# Altium schematic sheet 3.ETC.SchDoc
size A4; DrawnBy: Peter; Organization: WIZnet Co., Ltd.; Address1: 5F, Humax Village; Address2: Hwangseaul-ro, Bundang-Gu; Address3: Seongnam-Si, Gyeonggi-Do; Address4: South Korea; Team: Wiki
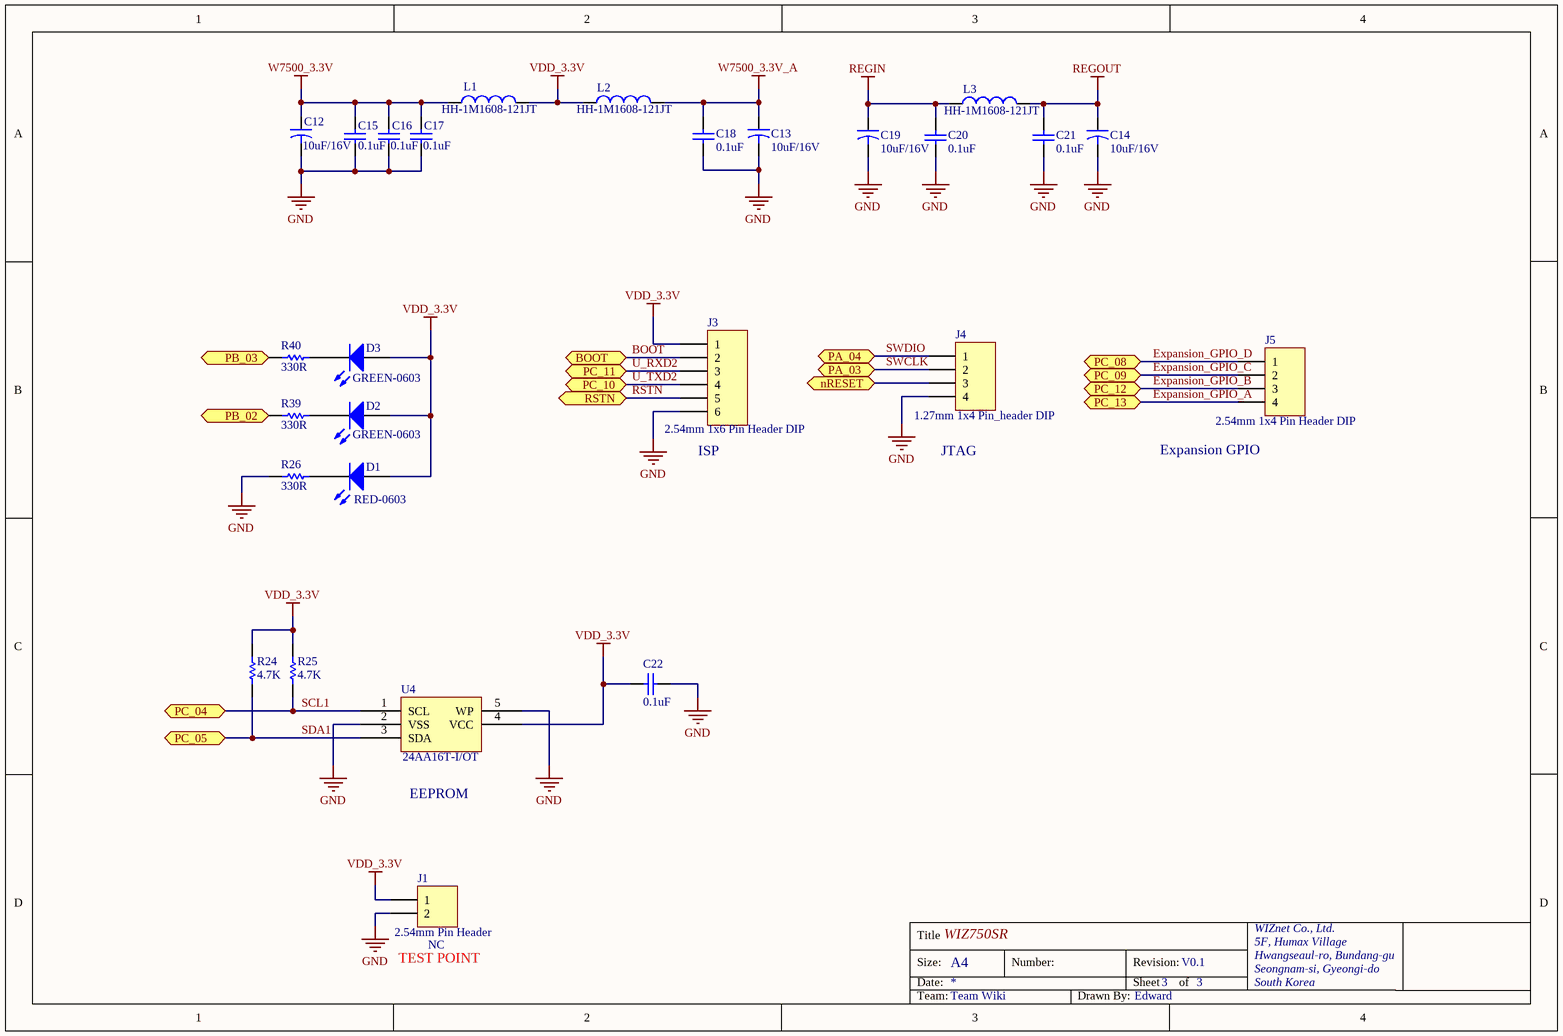
[diagram p0: 3.ETC.SchDoc]

## Parts
C12  10uF/16V  [CAP-A Size]
C13  10uF/16V  [CAP-A Size]
C14  10uF/16V  [CAP-A Size]
C15  0.1uF  [CAP-0402]
C16  0.1uF  [CAP-0402]
C17  0.1uF  [CAP-0402]
C18  0.1uF  [CAP-0402]
C19  10uF/16V  [CAP-A Size]
C20  0.1uF  [CAP-0402]
C21  0.1uF  [CAP-0402]
C22  0.1uF  [CAP-0402]
D1  RED-0603  [LED-0603-RED]
D2  GREEN-0603  [LED-0603-GREEN]
D3  GREEN-0603  [LED-0603-GREEN]
J1  2.54mm Pin Header  [IDC-1X2]
J3  2.54mm 1x6 Pin Header DIP  [IDC-1X6]
J4  1.27mm 1x4 Pin_header DIP
J5  2.54mm 1x4 Pin Header DIP  [IDC-1X4]
L1  HH-1M1608-121JT  [IND-0603]
L2  HH-1M1608-121JT  [IND-0603]
L3  HH-1M1608-121JT  [IND-0603]
R24  4.7K  [RES-0402]
R25  4.7K  [RES-0402]
R26  330R  [RES-0402]
R39  330R  [RES-0402]
R40  330R  [RES-0402]
U4  24AA16T-I/OT  [SOT-23-5L]

## Ports
BOOT, nRESET, PA_03, PA_04, PB_02, PB_03, PC_04, PC_05, PC_08, PC_09, PC_10, PC_11, PC_12, PC_13, RSTN

## Nets
GND: C12.2 C13.2 C14.2 C15.1 C16.1 C17.1 C18.1 C19.2 C20.1 C21.1 C22.1 J1.2 J3.6 J4.?4(4) R26.2 U4.2(VSS) U4.5(WP)
REGIN: C19.1 C20.2 L3.1
REGOUT: C14.1 C21.2 L3.2
VDD_3.3V: C22.2 D1.1(A) D2.1(A) D3.1(A) J1.1 J3.1 L1.2 L2.1 R24.2 R25.2 U4.4(VCC)
W7500_3.3V: C12.1 C15.2 C16.2 C17.2 L1.1
W7500_3.3V_A: C13.1 C18.2 L2.2
BOOT: J3.2 ; port BOOT
Expansion_GPIO_A: J5.4 ; port PC_13
Expansion_GPIO_B: J5.3 ; port PC_12
Expansion_GPIO_C: J5.2 ; port PC_09
Expansion_GPIO_D: J5.1 ; port PC_08
nRESET: J4.?3(3) ; port nRESET
PB_02: R39.2 ; port PB_02
PB_03: R40.2 ; port PB_03
RSTN: J3.5 ; port RSTN
SCL1: R25.1 U4.1(SCL) ; port PC_04
SDA1: R24.1 U4.3(SDA) ; port PC_05
SWCLK: J4.?2(2) ; port PA_03
SWDIO: J4.?1(1) ; port PA_04
U_RXD2: J3.3 ; port PC_11
U_TXD2: J3.4 ; port PC_10
NetD1_2: D1.2(K) R26.1
NetD2_2: D2.2(K) R39.1
NetD3_2: D3.2(K) R40.1

## Notes on the sheet
- (near J3) ISP
- (near J4) JTAG
- (near J5) Expansion GPIO
- (near U4) EEPROM
- (near J1) TEST POINT
- (near J1) NC
- Title
- Size:
- Date:
- WIZ750SR
- A4
- Number:
- Revision:
- Sheet
- 3
- of
- V0.1
- WIZnet Co., Ltd.
- 5F, Humax Village
- Hwangseaul-ro, Bundang-gu
- Seongnam-si, Gyeongi-do
- South Korea
- Team:
- Team Wiki
- Drawn By:
- Edward

## Library data of the parts
C12-C14 C19 = CAP-A Size: Tantla CAP A Size EIA/IECQ 3216
C15-C18 C20-C22 = CAP-0402: Ceramic CAP 0402(1005)
D1-D3 = LED-0603
J1 = Header 2: Header, 2-Pin; LatestRevisionDate: 17-Jul-2002; LatestRevisionNote: Re-released for DXP Platform.; Publisher: Altium Limited
J3 = Header 6: Header, 6-Pin; LatestRevisionDate: 17-Jul-2002; LatestRevisionNote: Re-released for DXP Platform.; Publisher: Altium Limited
J4 = 1.27mm 1x4 Pin header DIP: 1.27mm pitch 1x4 Pin header DIP Type
J5 = Header 4: Header, 4-Pin; LatestRevisionDate: 17-Jul-2002; LatestRevisionNote: Re-released for DXP Platform.; Publisher: Altium Limited
L1-L3 = IND-0603: Inductor 0603(1608)
R24-R26 R39 R40 = RES-0402
U4 = 24AAxxT-i-OT: SOT-23